# EAGLE design ABMS - VFG - AMPLIFIER (EAGLE 5.10)
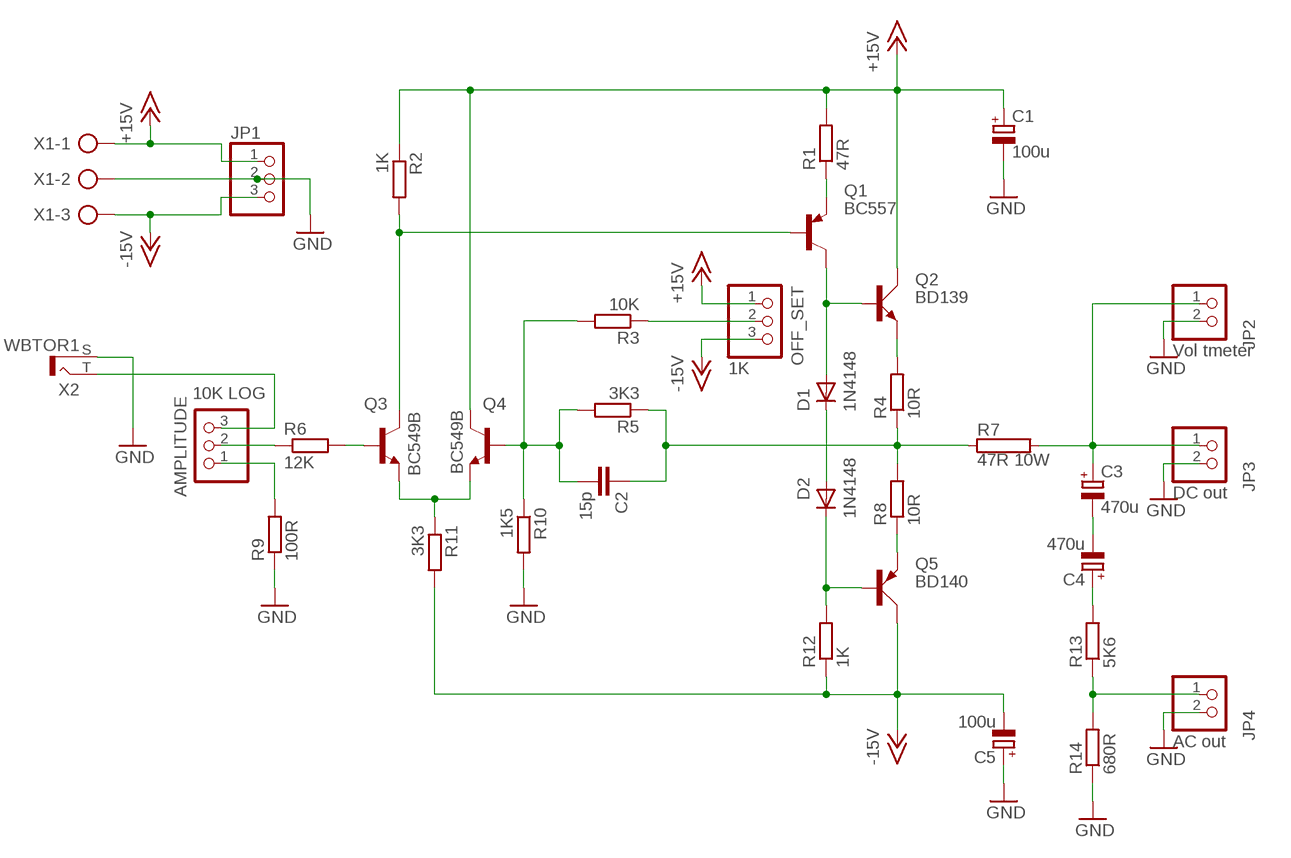
[diagram p0: schematic, sheet 1]

## Parts
AMPLITUDE  10K LOG  PINHD-1X3  [1X03]
C1  100u  CPOL-EUE5-8.5  [E5-8,5]
C2  15p  C-EU050-025X075  [C050-025X075]
C3  470u  CPOL-EUE5-8.5  [E5-8,5]
C4  470u  CPOL-EUE5-8.5  [E5-8,5]
C5  100u  CPOL-EUE5-8.5  [E5-8,5]
D1  1N4148  DIODE-DO35-10  [DO35-10]
D2  1N4148  DIODE-DO35-10  [DO35-10]
JP1  PINHD-1X3  [1X03]
JP2  Vol tmeter  PINHD-1X2  [1X02]
JP3  DC out  PINHD-1X2  [1X02]
JP4  AC out  PINHD-1X2  [1X02]
OFF_SET  1K  PINHD-1X3  [1X03]
Q1  BC557  [TO92-EBC]
Q2  BD139  [TO126AV]
Q3  BC549B  [TO92-EBC]
Q4  BC549B  [TO92-EBC]
Q5  BD140  [TO126AV]
R1  47R  R-EU_0207/10  [0207/10]
R2  1K  R-EU_0207/10  [0207/10]
R3  10K  R-EU_0207/10  [0207/10]
R4  10R  R-EU_0207/10  [0207/10]
R5  3K3  R-EU_0207/10  [0207/10]
R6  12K  R-EU_0207/10  [0207/10]
R7  47R 10W  RRWM8X45  [RWM8X45]
R8  10R  R-EU_0207/10  [0207/10]
R9  100R  R-EU_0207/10  [0207/10]
R10  1K5  R-EU_0207/10  [0207/10]
R11  3K3  R-EU_0207/10  [0207/10]
R12  1K  R-EU_0207/10  [0207/10]
R13  5K6  R-EU_0207/10  [0207/10]
R14  680R  R-EU_0207/10  [0207/10]
X1  AK300/3  [AK300/3]
X2  WBTOR1  [WBTOR1]

## Nets
+15V: C1.+ JP1.1 OFF_SET.1 Q2.C Q4.C R1.2 R2.1 X1.1
-15V: C5.- JP1.3 OFF_SET.3 Q5.C R11.2 R12.1 X1.3
GND: C1.- C5.+ JP1.2 JP2.2 JP3.2 JP4.2 R9.1 R10.2 R14.1 X1.2 X2.S
N$1: AMPLITUDE.3 X2.T
N$42: Q5.E R8.1
N$43: Q2.E R4.2
N$44: C2.1 R4.1 R5.1 R7.1 R8.2
N$45: C3.+ JP2.1 JP3.1 R7.2
N$46: C3.- C4.-
N$47: JP4.1 R13.1 R14.2
N$48: C4.+ R13.2
N$49: OFF_SET.2 R3.1
N$50: D2.C Q5.B R12.2
N$51: D1.C D2.A
N$52: Q3.E Q4.E R11.1
N$53: Q3.B R6.2
N$54: D1.A Q1.C Q2.B
N$55: Q1.E R1.1
N$56: AMPLITUDE.2 R6.1
N$57: C2.2 Q4.B R3.2 R5.2 R10.1
N$58: AMPLITUDE.1 R9.2
N$59: Q1.B Q3.C R2.2

## Library data of the parts
AMPLITUDE JP1 OFF_SET = pinhead:PINHD-1X3: PIN HEADER
C1 C3-C5 = resistor:CPOL-EU: POLARIZED CAPACITOR, European symbol
C2 = resistor:C-EU: CAPACITOR, European symbol
D1 D2 = diode:DIODE-: DIODE
JP2-JP4 = pinhead:PINHD-1X2: PIN HEADER
Q1 = transistor-pnp:BC557*: PNP Transistror
Q2 = transistor-power:BD139: NPN TRANSISTOR
Q3 Q4 = transistor-npn:BC549*: NPN Transistor
Q5 = transistor-power:BD140: PNP TRANSISTOR
R1-R6 R8-R14 = resistor:R-EU_: RESISTOR, European symbol
R7 = resistor-power:R: Power Resitor
X1 = con-ptr500:AK300/3: CONNECTOR
X2 = con-lumberg:WBTOR1: RCA connectors according to JEITA RC-5231 Cinch RCA-Einbaukupplung nach JEITA RC-5231, abgewinkelte Ausführung Source: http://www.lumberg.de/Produkte/PDFs/WBTOR1.pdf

## Net classes
0 default: width 0.635 mm, drill 0.762 mm, clearance 0.508 mm

## Board
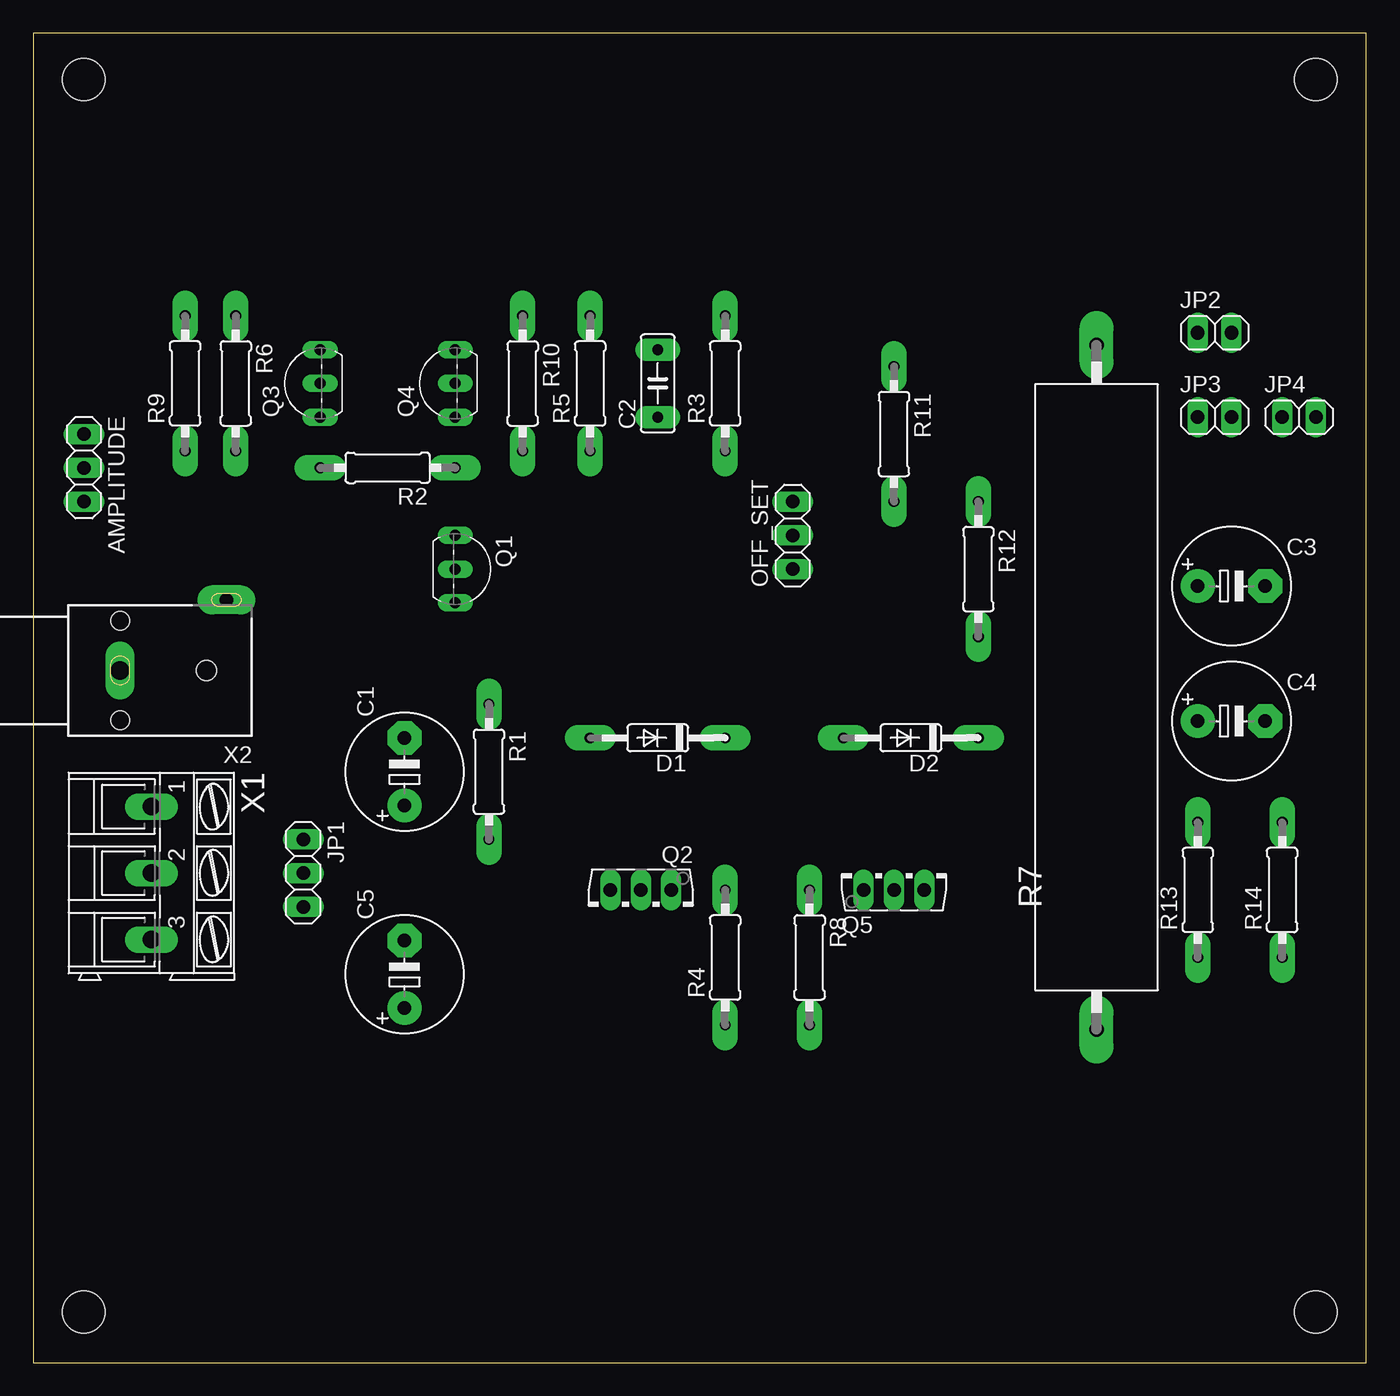
[diagram p1: board, top side]
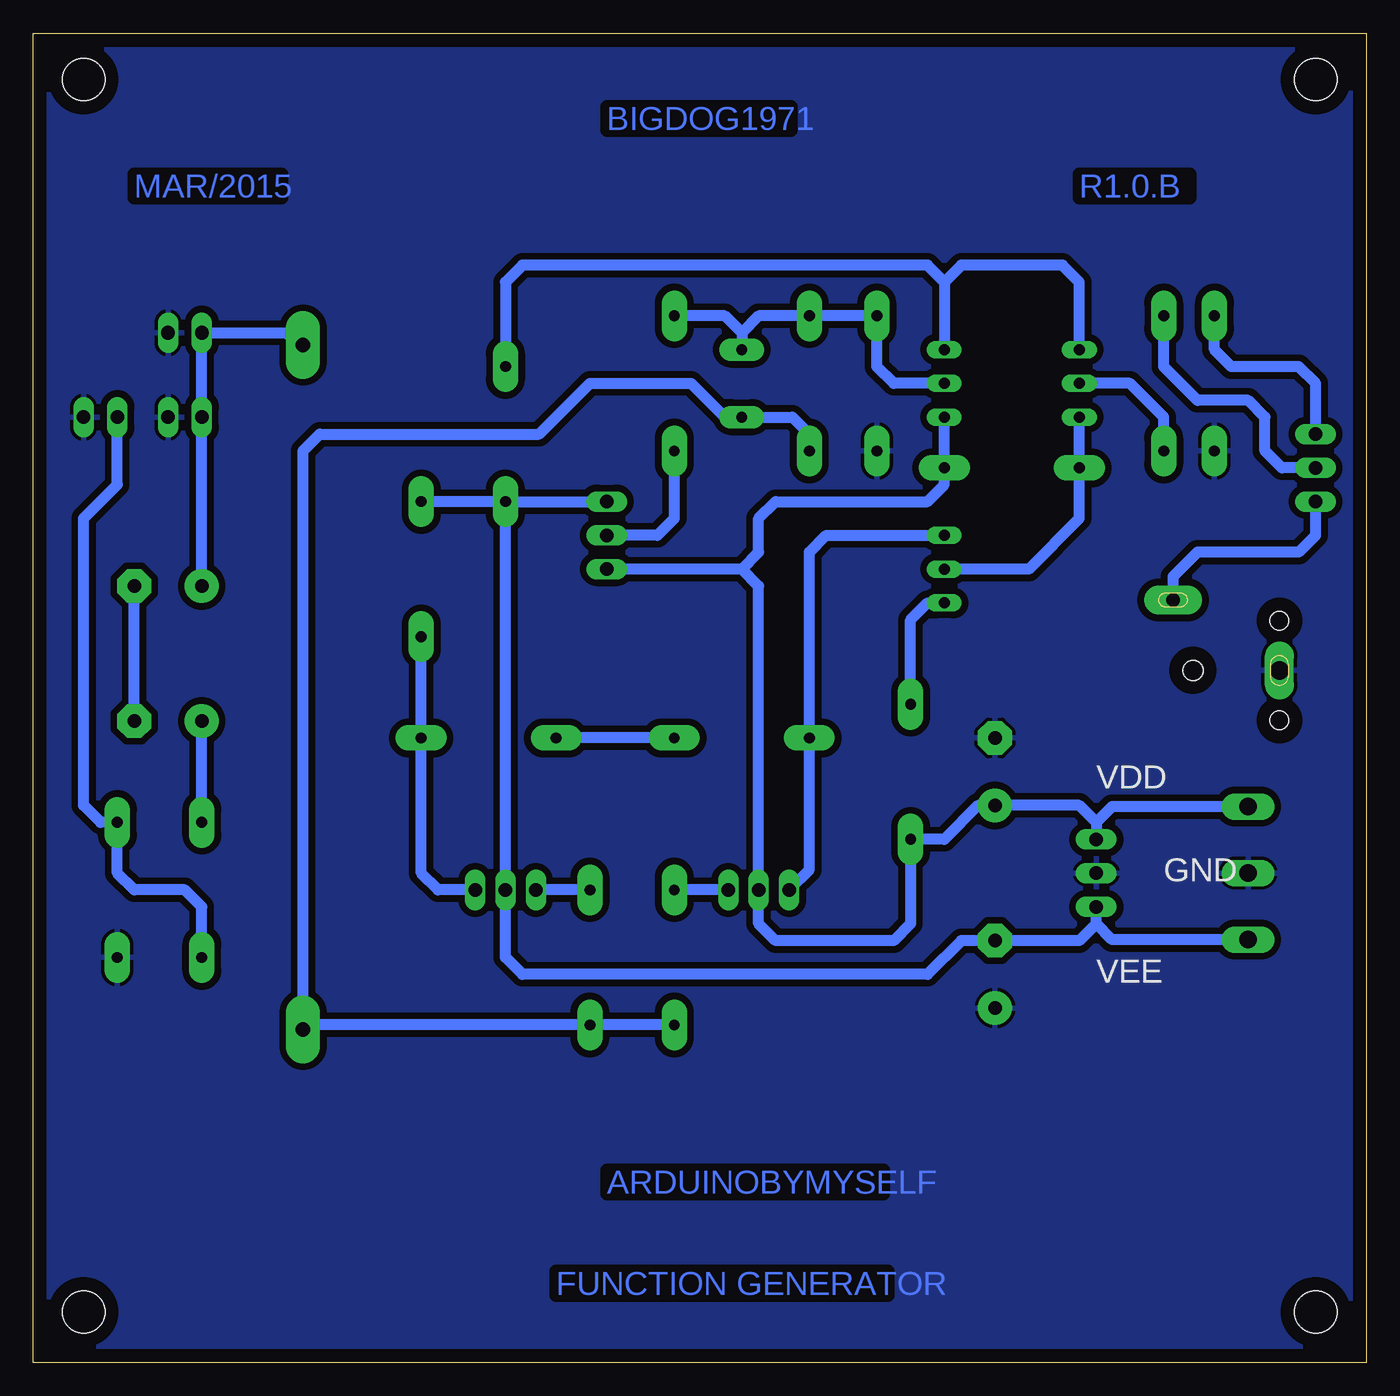
[diagram p2: board, bottom side, seen from below]

Size 100.31 x 100 mm. Coordinates in mm from the lower left corner, seen from the top.
Outline: 0,0 100.31,0 100.31,100 0,100 0,0
Copper layers (1*16): Top 0.035mm / dielectric 1.5mm / Bottom 0.035mm
Design rules "default": minimum track width 10mil, minimum drill 24mil, track to track 8mil, track to pad 8mil, pad to pad 8mil, via to via 8mil, smd to smd 8mil, copper to edge 40mil, drill to drill 8mil, minimum pad ring 10mil, minimum via ring 8mil, stop-mask expansion 4mil, vias tented up to drill 0mil, thermal gap 10mil
Holes 3.2 mm at 3.81,3.81 3.81,96.52 96.52,3.81 96.52,96.52

### Footprints (pad centres in the part's own frame; a part is rotated, then mirrored left to right if it is on the bottom)
1X03 = drill 1.016 long: 1 -2.54,0; 2 0,0; 3 2.54,0
E5-8,5 = drill 1.016 pad 2.54 round: + -2.54,0 | drill 1.016 pad 2.54 octagon: - 2.54,0
C050-025X075 = drill 0.813 pad 1.676 long: 1 -2.54,0; 2 2.54,0
DO35-10 = drill 0.813 pad 1.93 long: A 5.08,0; C -5.08,0
1X02 = drill 1.016 long: 1 -1.27,0; 2 1.27,0
TO92-EBC = drill 0.813 long: B 0,-1.27; C -2.54,-1.27; E 2.54,-1.27
TO126AV = drill 1.016 long: B 2.286,-1.27; C 0,-1.27; E -2.286,-1.27
0207/10 = drill 0.813 pad 1.93 long: 1 -5.08,0; 2 5.08,0
RWM8X45 = drill 1.1 pad 2.54 long: 1 -25.74,0; 2 25.74,0
AK300/3 = drill 1.321 long: 1 -5.004,0; 2 0,0; 3 5.004,0
WBTOR1 = drill 1.4 pad 2.2 long: S 0,-4 | drill 1 pad 2.2 long: T 5.3,-12 | hole 1.4: -3.75,-4; 3.75,-4 | hole 1.5: 0,-10.5

### Placement (x,y rotation side)
AMPLITUDE  3.81,67.31 270 top
C1  27.94,44.45 90 top
C2  46.99,73.66 90 top
C3  90.17,58.42 0 top
C4  90.17,48.26 0 top
C5  27.94,29.21 90 top
D1  46.99,46.99 180 top
D2  66.04,46.99 180 top
JP1  20.32,36.83 270 top
JP2  88.9,77.47 0 top
JP3  88.9,71.12 0 top
JP4  95.25,71.12 0 top
OFF_SET  57.15,62.23 90 top
Q1  33.02,59.69 270 top
Q2  45.72,34.29 180 top
Q3  20.32,73.66 90 top
Q4  30.48,73.66 90 top
Q5  64.77,36.83 0 top
R1  34.29,44.45 270 top
R2  26.67,67.31 180 top
R3  52.07,73.66 90 top
R4  52.07,30.48 90 top
R5  41.91,73.66 90 top
R6  15.24,73.66 270 top
R7  80.01,50.8 90 top
R8  58.42,30.48 270 top
R9  11.43,73.66 90 top
R10  36.83,73.66 270 top
R11  64.77,69.85 270 top
R12  71.12,59.69 270 top
R13  87.63,35.56 90 top
R14  93.98,35.56 90 top
X1  8.89,36.83 270 top
X2  2.54,52.07 90 top

### Tracks (layer width: path | path; a pad name or v marks a point on that pad's centre or on a via)
+15V
  Bottom 0.813: Q4.C R2.1 31.75,66.04 33.02,64.77 44.45,64.77 45.72,63.5 45.72,60.96 46.99,59.69 | 46.99,59.69 OFF_SET.1 | 46.99,59.69 45.72,58.42 Q2.C 45.72,33.02 44.45,31.75 35.56,31.75 34.29,33.02 R1.2 31.75,39.37 29.21,41.91 C1.+ 21.59,41.91 20.32,40.64 | X1.1 19.13,41.83 20.32,40.64 | 20.32,40.64 JP1.1
-15V
  Bottom 0.813: X1.3 19.13,31.83 20.32,33.02 | 20.32,33.02 JP1.3 | 20.32,33.02 21.59,31.75 C5.- 30.48,31.75 33.02,29.21 63.5,29.21 64.77,30.48 Q5.C R11.2 | R11.2 OFF_SET.3 | R11.2 R12.1
GND
  pour Bottom: -1.27,101.6 101.6,101.6 101.6,0 -1.27,-1.27
N$1
  Bottom 0.813: X2.T 14.54,59.12 12.7,60.96 5.08,60.96 3.81,62.23 AMPLITUDE.3
N$42
  Bottom 0.813: R8.1 Q5.E
N$43
  Bottom 0.813: Q2.E R4.2
N$44
  Bottom 0.813: R5.1 41.91,69.85 43.18,71.12 C2.1 48.26,71.12 50.8,73.66 58.42,73.66 62.23,69.85 78.74,69.85 80.01,68.58 R7.1 79.67,25.4 R8.2 R4.1
N$45
  Bottom 0.813: C3.+ JP3.1 JP2.1 81.28,77.47 80.35,76.54 R7.2
N$46
  Bottom 0.813: C4.- C3.-
N$47
  Bottom 0.813: R13.1 87.63,34.29 88.9,35.56 92.71,35.56 93.98,36.83 R14.2 95.25,40.64 96.52,41.91 96.52,63.5 93.98,66.04 JP4.1
N$48
  Bottom 0.813: R13.2 C4.+
N$49
  Bottom 0.813: R3.1 52.07,63.5 53.34,62.23 OFF_SET.2
N$50
  Bottom 0.813: Q5.B 69.85,35.56 71.12,36.83 D2.C R12.2
N$51
  Bottom 0.813: D1.C D2.A
N$52
  Bottom 0.813: 31.75,81.28 Q4.E | 31.75,81.28 33.02,82.55 63.5,82.55 64.77,81.28 R11.1 | Q3.E 21.59,81.28 22.86,82.55 30.48,82.55 31.75,81.28
N$53
  Bottom 0.813: R6.2 15.24,71.12 17.78,73.66 Q3.B
N$54
  Bottom 0.813: Q1.C 40.64,62.23 41.91,60.96 D1.A 41.91,37.08 Q2.B
N$55
  Bottom 0.813: Q1.E 33.02,57.15 34.29,55.88 R1.1
N$56
  Bottom 0.813: AMPLITUDE.2 6.35,67.31 7.62,68.58 7.62,71.12 8.89,72.39 12.7,72.39 15.24,74.93 R6.1
N$57
  Bottom 0.813: Q4.B 35.56,73.66 36.83,74.93 R10.1 R5.2 45.72,78.74 46.99,77.47 | 46.99,77.47 C2.2 | 46.99,77.47 48.26,78.74 R3.2
N$58
  Bottom 0.813: AMPLITUDE.1 3.81,73.66 5.08,74.93 10.16,74.93 11.43,76.2 R9.2
N$59
  Bottom 0.813: Q3.C R2.2 21.59,63.5 25.4,59.69 Q1.B

### Text on the board
Bottom: BIGDOG1971 | R1.0.B | MAR/2015 | ARDUINOBYMYSELF | FUNCTION GENERATOR
bNames: VDD | GND | VEE